# EAGLE design BB Power Supply (EAGLE 7.5.0)
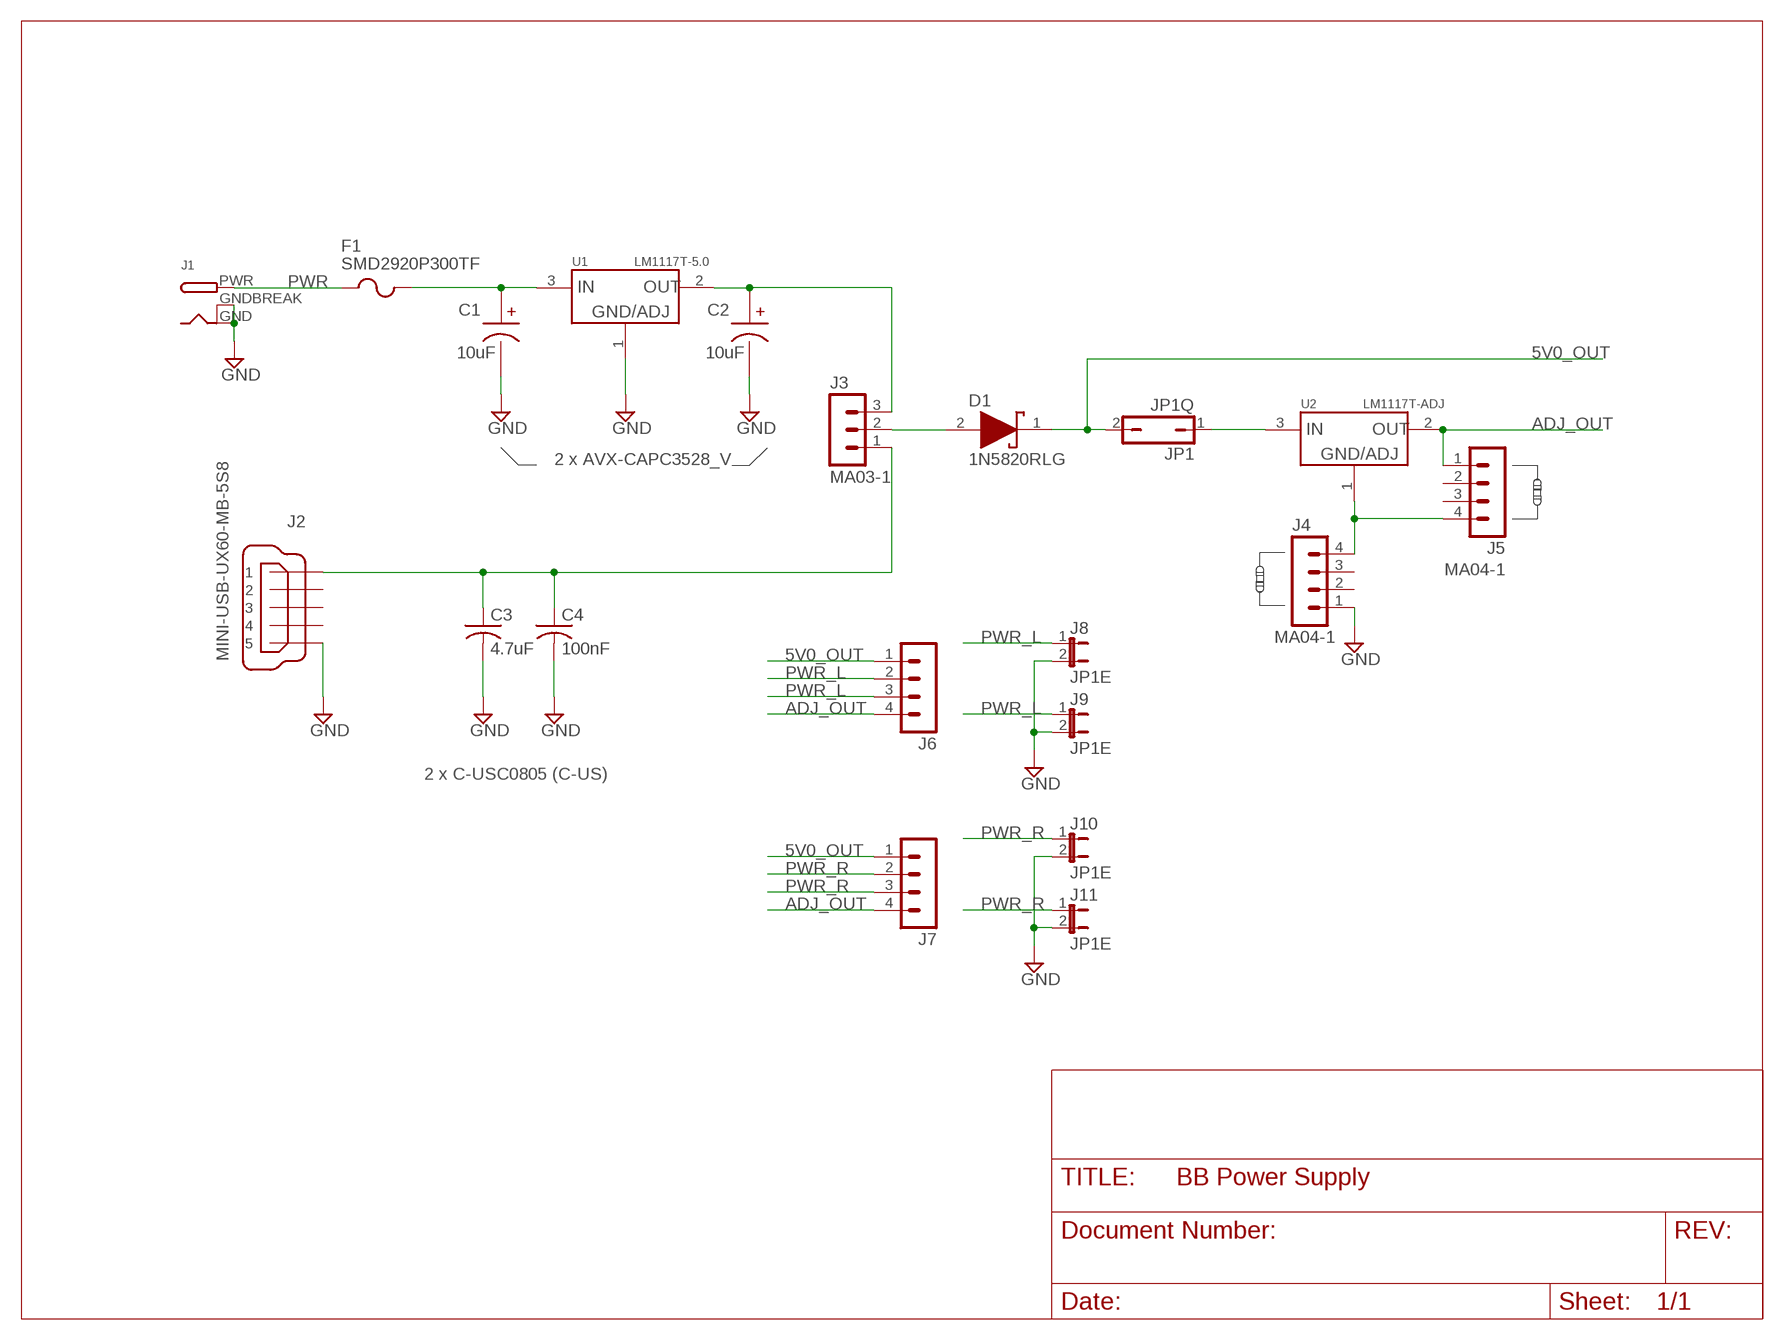
[diagram p0: schematic, sheet 1]

## Parts
C1  10uF  TAJB106K020R  [AVX-CAPC3528_V]
C2  10uF  TAJB106K020R  [AVX-CAPC3528_V]
C3  4.7uF  C-USC0805  [C0805]
C4  100nF  C-USC0805  [C0805]
D1  1N5820RLG  [ONSC-AXIAL_LEAD-2-267-05_V]
F1  SMD2920P300TF  [FUSE2920]
J1  DCBARRELPTH  [DCJACK_2MM_PTH]
J2  MINI-USB-UX60-MB-5S8  [UX60-MB-5S8]
J3  MA03-1  [MA03-1]
J4  MA04-1  [MA04-1]
J5  MA04-1  [MA04-1]
J6  MA04-1  [MA04-1]
J7  MA04-1  [MA04-1]
J8  JP1E  [JP1]
J9  JP1E  [JP1]
J10  JP1E  [JP1]
J11  JP1E  [JP1]
JP1  JP1Q  [JP1]
U1  LM1117T-5.0  [TO-220]
U2  LM1117T-ADJ  [TO-220]

## Nets
5V0_OUT: D1.1(K) J6.1 J7.1 JP1.2
ADJ_OUT: J5.1 J6.4 J7.4 U2.2(OUT)
GND: C1.2 C2.2 C3.2 C4.2 J1.GND J1.GNDBREAK J2.5 J4.1 J8.2 J9.2 J10.2 J11.2 U1.1(GND)
N$1: C1.1 F1.2 U1.3(IN)
N$2: C2.1 J3.3 U1.2(OUT)
N$3: D1.2(A) J3.2
N$5: C3.1 C4.1 J2.1 J3.1
N$6: JP1.1 U2.3(IN)
N$9: J4.4 J5.4 U2.1(GND)
PWR: F1.1 J1.PWR
PWR_L: J6.2 J6.3 J8.1 J9.1
PWR_R: J7.2 J7.3 J10.1 J11.1
Unconnected: J2.2 J2.3 J2.4 J4.2 J4.3 J5.2 J5.3

## Notes on the sheet
- SMD2920P300TF
- 2 x AVX-CAPC3528_V
- 2 x C-USC0805 (C-US)

## Library data of the parts
C1 C2 = Workshop 1:TAJB106K020R
C3 C4 = adafruit:C-US: CAPACITOR, American symbol
D1 = Workshop 1:1N5820RLG
F1 = Workshop 1:SMD2920P300TF
J1 = adafruit:DCBARREL: 2.0mm DC Barrel Jack DCJACK_2MM_PTH - Through Hole Jack (4UConnector: 05537)
J2 = con-hirose:MINI-USB-: MINI USB Connector Source: http://www.hirose.co.jp/cataloge_hp/e24000019.pdf; OC_FARNELL: unknown; OC_NEWARK: unknown
J3 = con-lstb:MA03-1: PIN HEADER; OC_FARNELL: unknown; OC_NEWARK: unknown
J4-J7 = con-lstb:MA04-1: PIN HEADER; OC_FARNELL: unknown; OC_NEWARK: unknown
J8-J11 = jumper:JP1E: JUMPER
JP1 = jumper:JP1Q: JUMPER
U1 = Workshop 1:LM1117T-5.0
U2 = Workshop 1:LM1117T-ADJ

## Board
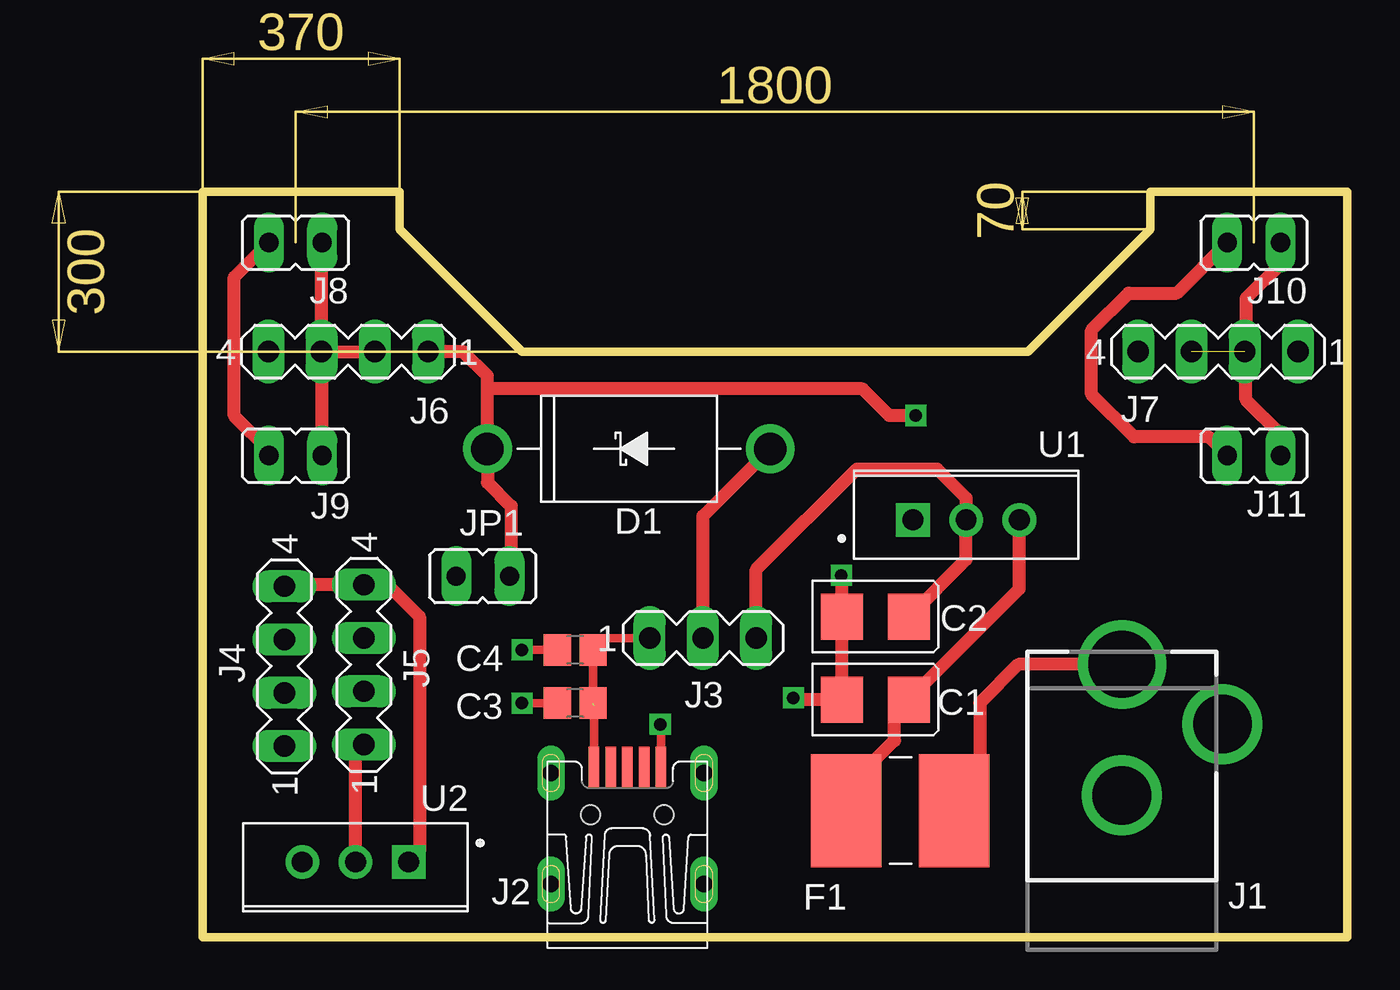
[diagram p1: board, top side]
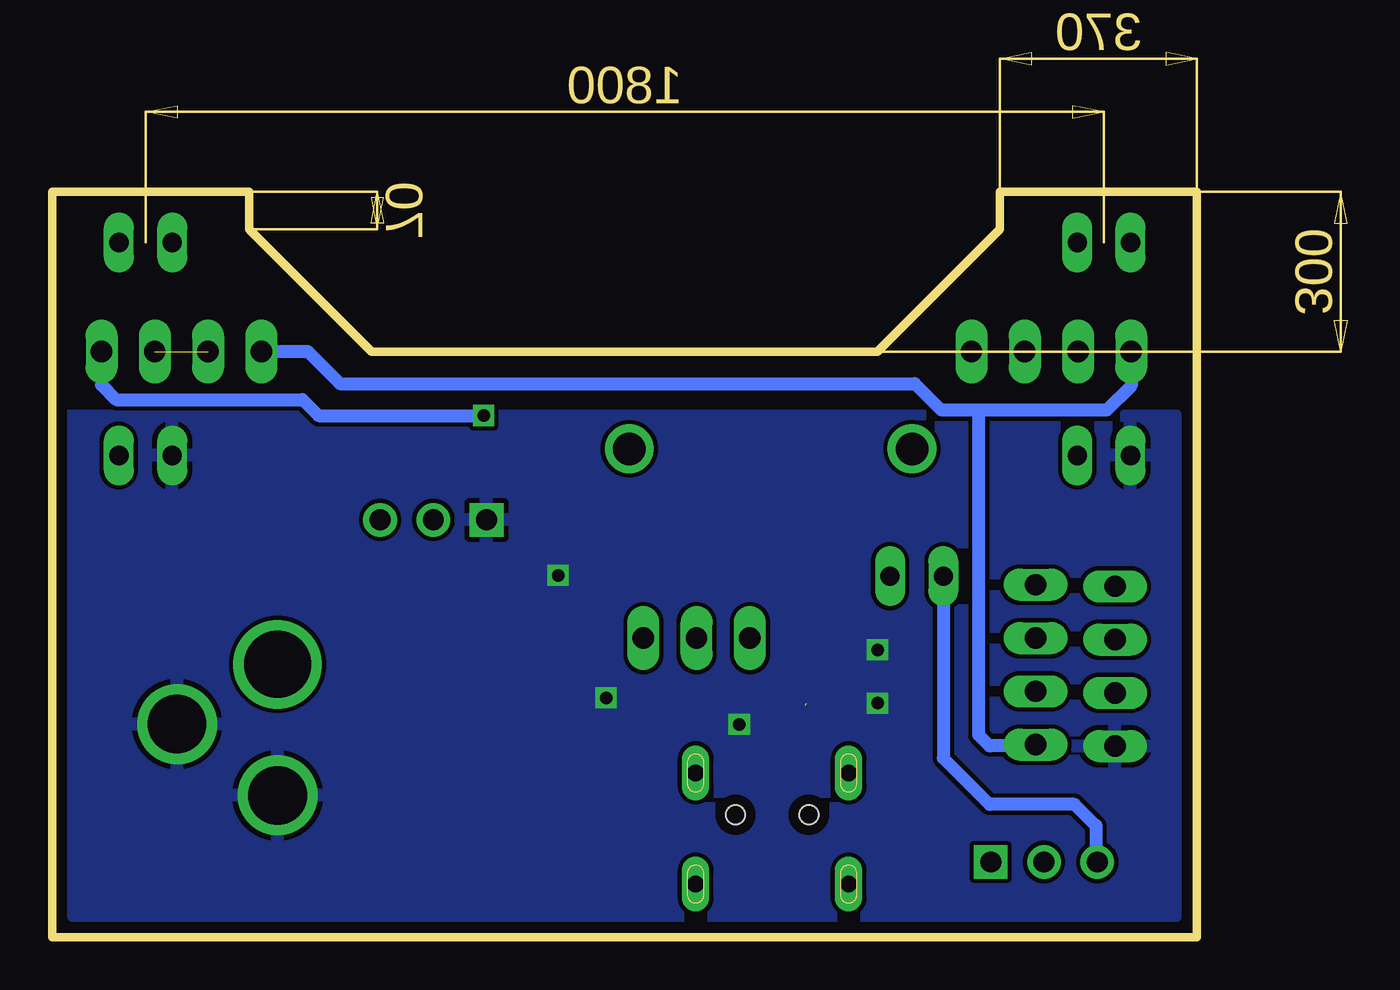
[diagram p2: board, bottom side, seen from below]

Size 54.61 x 35.56 mm. Coordinates in mm from the lower left corner, seen from the top.
Outline: 0,0 0,35.56 9.4,35.56 9.4,33.78 15.24,27.94 39.37,27.94 45.21,33.78 45.21,35.56 54.61,35.56 54.61,0 0,0
Copper layers (1*16): Top 0.035mm / dielectric 1.5mm / Bottom 0.035mm
Design rules "default *": minimum track width 10mil, minimum drill 20mil, track to track 8mil, track to pad 8mil, pad to pad 8mil, via to via 8mil, smd to smd 8mil, copper to edge 20mil, drill to drill 8mil, minimum pad ring 10mil, minimum via ring 8mil, stop-mask expansion 4mil, vias tented up to drill 0mil, thermal gap 10mil

### Footprints (pad centres in the part's own frame; a part is rotated, then mirrored left to right if it is on the bottom)
AVX-CAPC3528_V = smd 2 x 2.2: 1 0,0; 2 3.2,0
C0805 = smd 1.3 x 1.5: 1 -0.85,0; 2 0.85,0
ONSC-AXIAL_LEAD-2-267-05_V = drill 1.55 pad 2.05: 1 0,0; 2 13.49,0
FUSE2920 = smd 3.35 x 5.4: 1 0,0; 2 5.15,0
DCJACK_2MM_PTH = drill 2.8: GND 0,7.35; GNDBREAK 4.8,10.75 | drill 3.2: PWR 0,13.6
UX60-MB-5S8 = smd 2 x 0.5: 1 8.65,1.6; 2 8.65,0.8; 3 8.65,0; 4 8.65,-0.8; 5 8.65,-1.6 | drill 0.8 long: M1 3.1,-3.65; M2 3.1,3.65; M3 8.4,3.65; M4 8.4,-3.65 | hole 0.9: 6.4,-1.75; 6.4,1.75
MA03-1 = drill 1.016 long: 1 -2.54,0; 2 0,0; 3 2.54,0
MA04-1 = drill 1.016 long: 1 -3.81,0; 2 -1.27,0; 3 1.27,0; 4 3.81,0
JP1 = drill 0.914 long: 1 0,-1.27; 2 0,1.27
TO-220 = drill 1 pad 1.6 square: 1 0,0 | drill 1 pad 1.6: 2 2.54,0; 3 5.08,0

### Placement (x,y rotation side)
C1  33.71,11.35 180 top
C2  33.71,15.3 180 top
C3  17.78,11.18 180 top
C4  17.78,13.72 180 top
D1  13.6,23.3 0 top
F1  35.86,6.05 180 top
J1  43.87,-0.57 0 top
J2  20.27,-0.55 90 top
J3  23.88,14.28 0 top
J4  3.91,12.94 90 top
J5  7.71,13.01 90 top
J6  6.95,27.94 180 top
J7  48.46,27.94 180 top
J8  4.45,33.15 90 top
J9  4.45,22.99 90 top
J10  50.16,33.15 90 top
J11  50.16,22.99 90 top
JP1  13.38,17.23 270 top
U1  33.9,19.92 0 top
U2  9.84,3.6 180 top

### Tracks (layer width: path | path; a pad name or v marks a point on that pad's centre or on a via)
5V0_OUT  (via drill 0.6)
  Top 0.61: 13.6,26.16 D1.1 13.6,21.7 14.73,20.57 14.73,17.32 JP1.2 | 13.6,26.16 13.6,26.78 12.45,27.94 J6.1 | v34.04,24.89 32.77,24.89 31.5,26.16 13.6,26.16
  Bottom 0.61: J7.1 52.27,26.36 51.56,25.65 42.67,25.65 41.91,24.89 v34.04,24.89
ADJ_OUT
  Top 0.61: U2.2 7.3,8.8 J5.1
  Bottom 0.61: J6.4 3.14,26.32 4.32,25.15 10.41,25.15 | 10.41,25.15 12.19,25.15 13.46,26.42 40.89,26.42 42.42,27.94 J7.4 | J5.1 7.77,9.14 9.91,9.14 10.41,9.65 10.41,25.15
GND  (via drill 0.6)
  Top 0.406: J2.5 21.87,10.23 21.87,10.24 21.87,10.19 v21.84,10.16 | C4.2 v15.24,13.72 | C3.2 v15.24,11.18
  Top 0.61: J9.2 3.17,23.24 1.52,24.89 1.52,31.5 J8.2 | J11.2 48.01,23.88 44.45,23.88 42.42,25.91 42.42,28.96 44.2,30.73 46.48,30.73 J10.2 | v28.19,11.43 28.25,11.38 28.25,11.33 28.26,11.35 C1.2 C2.2 30.51,17.13 30.53,17.14 30.53,17.22 v30.48,17.27
  pour Bottom: 1.02,1.02 53.59,1.02 53.85,24.89 1.02,24.89
N$1
  Top 0.61: F1.2 30.71,7.09 33.02,9.4 33.02,10.66 C1.1 38.98,16.62 U1.3
N$2
  Top 0.61: C2.1 36.44,18.03 U1.2 36.44,20.97 35.05,22.35 31.24,22.35 26.42,17.53 J3.3
N$3
  Top 0.61: J3.2 23.88,20.09 D1.2
N$5  (1 unrouted)
  Top 0.406: 18.67,11.05 J2.1 | C3.1 C4.1 19.2,14.28 J3.1
N$6
  Bottom 0.61: U2.3 4.83,3.66 4.83,5.33 5.84,6.35 9.91,6.35 12.11,8.55 JP1.1
N$9
  Top 0.61: J4.4 3.99,16.82 J5.4 7.77,16.76 8.89,16.76 10.35,15.3 10.35,4.11 U2.1
PWR
  Top 0.61: J1.PWR 38.93,13.03 37.08,11.18 37.08,7.27 F1.1
PWR_L
  Top 0.61: J9.1 5.71,27.9 J6.3 | J6.3 J6.2 | J6.3 5.68,33.11 J8.1
PWR_R  (1 unrouted)
  Top 0.61: J11.1 51.44,24 49.78,25.65 49.78,27.88 J7.2 49.78,28 49.78,30.48 51.44,32.13 J10.1